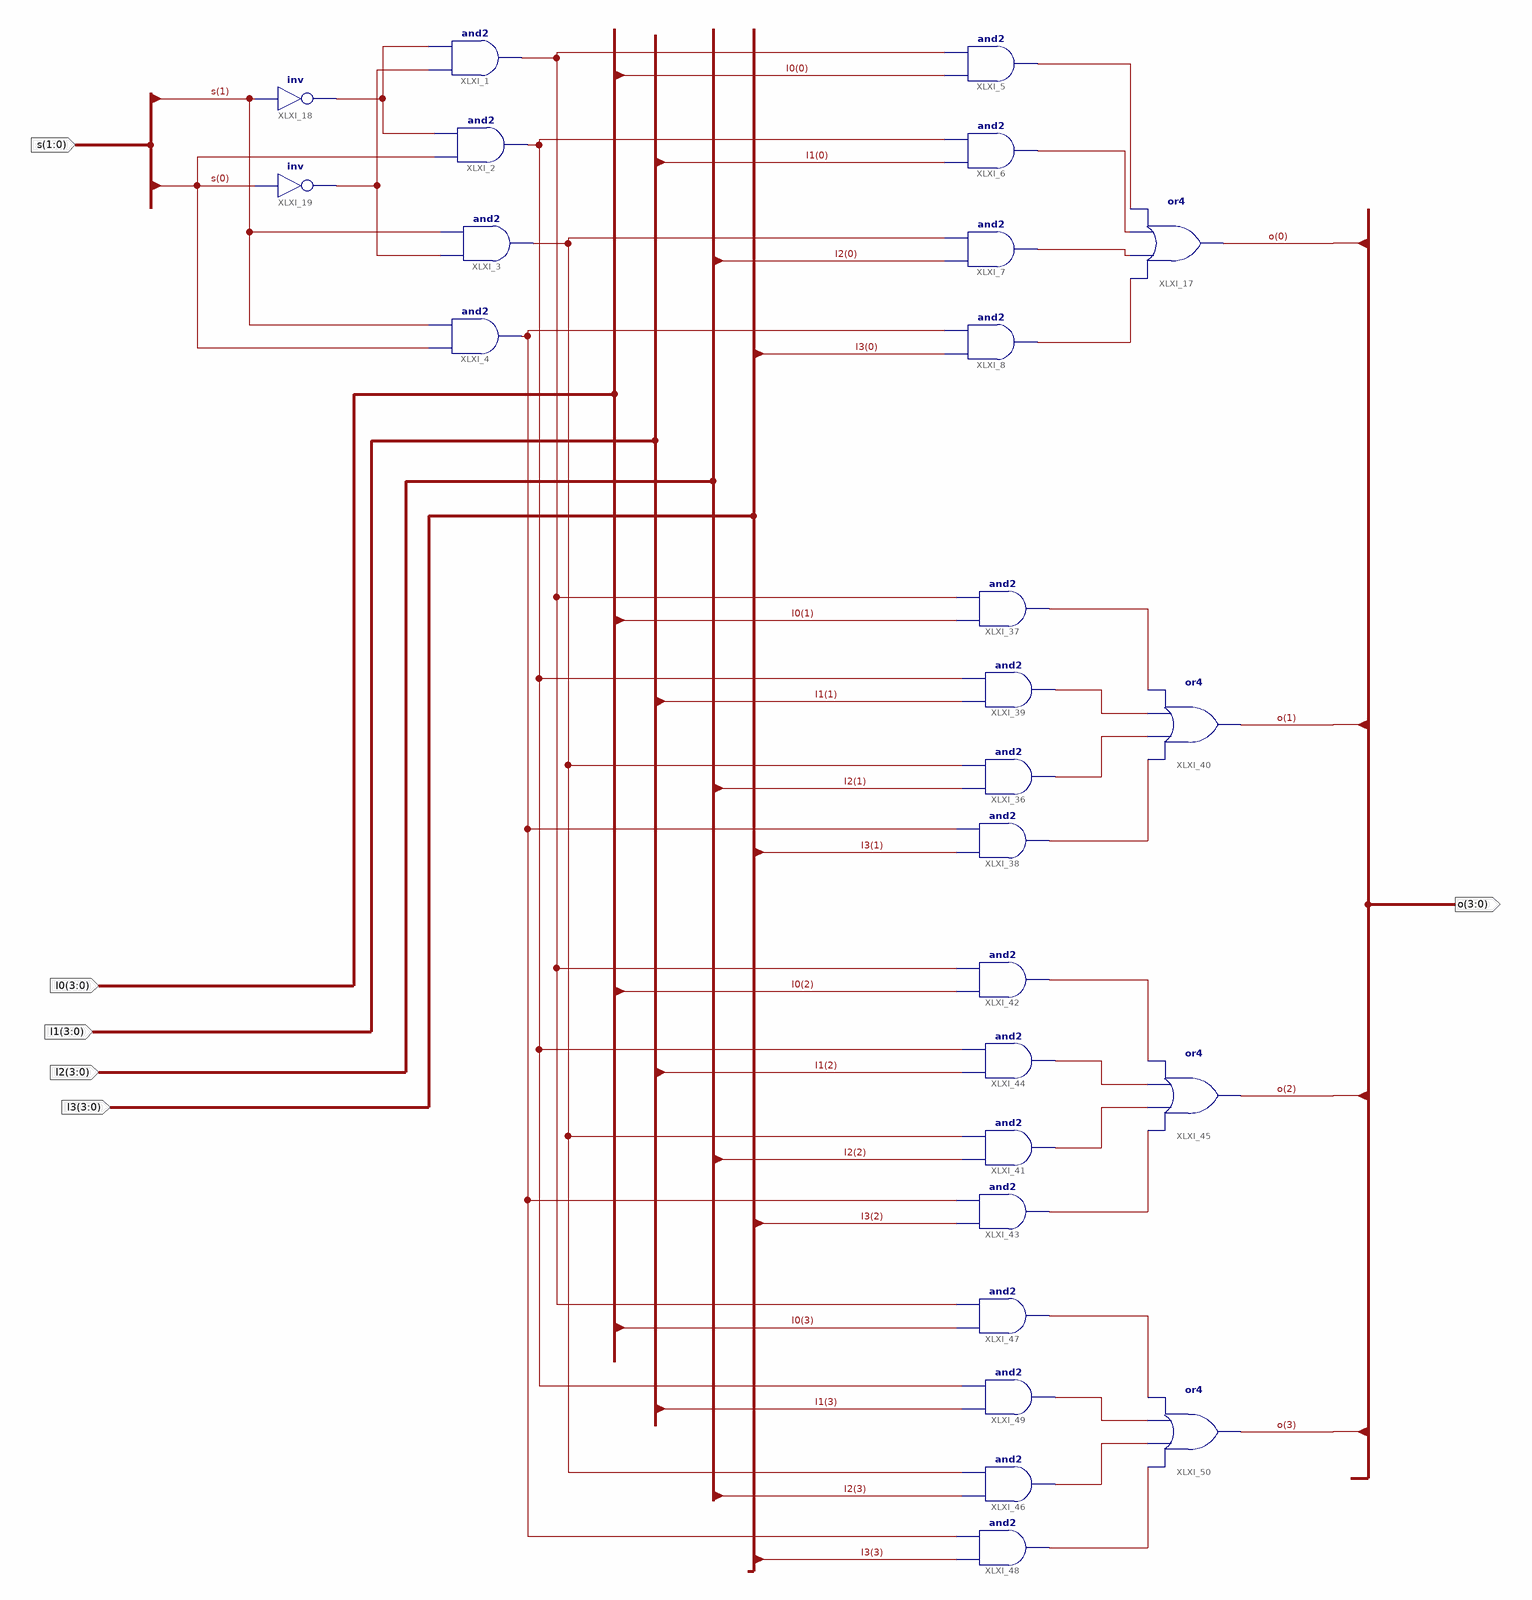
[diagram p0: schematic sheet 1]
// Xilinx ISE schematic MUX4T1_4.sch (kintex7) as structural Verilog: 26 symbols, 6 ports
module MUX4T1_4 (
  input  [1:0] s,
  input  [3:0] I0,
  input  [3:0] I1,
  input  [3:0] I2,
  input  [3:0] I3,
  output [3:0] o
);

  wire XLXN_16, XLXN_17, XLXN_18, XLXN_19, XLXN_26, XLXN_30, XLXN_39, XLXN_40, XLXN_41, XLXN_42, XLXN_43,
       XLXN_44, XLXN_45, XLXN_46, XLXN_47, XLXN_48, XLXN_49, XLXN_50, XLXN_53, XLXN_56, XLXN_59, XLXN_62;

  not XLXI_18 (XLXN_26, s[1]);
  not XLXI_19 (XLXN_30, s[0]);
  and XLXI_1 (XLXN_53, XLXN_30, XLXN_26);
  and XLXI_2 (XLXN_56, s[0], XLXN_26);
  and XLXI_3 (XLXN_59, XLXN_30, s[1]);
  and XLXI_4 (XLXN_62, s[0], s[1]);
  or XLXI_17 (o[0], XLXN_19, XLXN_18, XLXN_17, XLXN_16);
  and XLXI_36 (XLXN_41, I2[1], XLXN_59);
  and XLXI_37 (XLXN_39, I0[1], XLXN_53);
  and XLXI_38 (XLXN_42, I3[1], XLXN_62);
  and XLXI_39 (XLXN_40, I1[1], XLXN_56);
  or XLXI_40 (o[1], XLXN_42, XLXN_41, XLXN_40, XLXN_39);
  and XLXI_41 (XLXN_45, I2[2], XLXN_59);
  and XLXI_42 (XLXN_43, I0[2], XLXN_53);
  and XLXI_43 (XLXN_46, I3[2], XLXN_62);
  and XLXI_44 (XLXN_44, I1[2], XLXN_56);
  or XLXI_45 (o[2], XLXN_46, XLXN_45, XLXN_44, XLXN_43);
  and XLXI_46 (XLXN_49, I2[3], XLXN_59);
  and XLXI_47 (XLXN_47, I0[3], XLXN_53);
  and XLXI_48 (XLXN_50, I3[3], XLXN_62);
  and XLXI_49 (XLXN_48, I1[3], XLXN_56);
  or XLXI_50 (o[3], XLXN_50, XLXN_49, XLXN_48, XLXN_47);
  and XLXI_8 (XLXN_19, I3[0], XLXN_62);
  and XLXI_7 (XLXN_18, I2[0], XLXN_59);
  and XLXI_5 (XLXN_16, I0[0], XLXN_53);
  and XLXI_6 (XLXN_17, I1[0], XLXN_56);
endmodule
